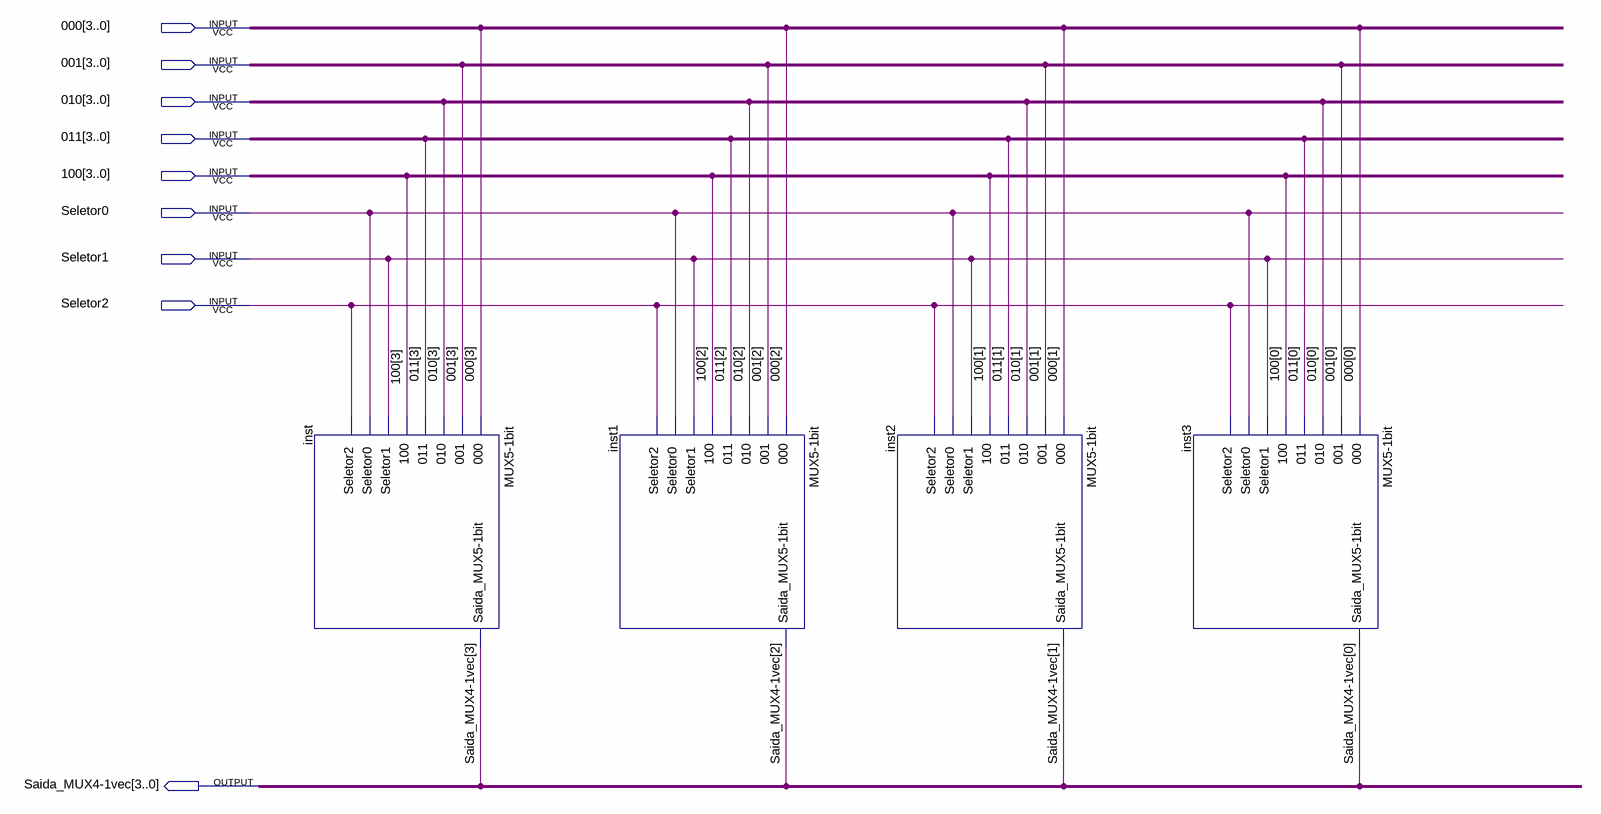
[diagram p0: schematic sheet]
// Quartus schematic MUX5-1vec.bdf as structural Verilog: 4 symbols, 9 pins
module \MUX5-1vec  (
  input  [3:0] \000 ,
  input  [3:0] \001 ,
  input  [3:0] \010 ,
  input  [3:0] \011 ,
  input  [3:0] \100 ,
  input  Seletor0,
  input  Seletor1,
  input  Seletor2,
  output [3:0] \Saida_MUX4-1vec 
);

  \MUX5-1bit  inst (
    .\000 (\000 [3]), .\001 (\001 [3]), .\010 (\010 [3]), .\011 (\011 [3]), .\100 (\100 [3]),
    .Seletor1(Seletor1), .Seletor0(Seletor0), .Seletor2(Seletor2), .\Saida_MUX5-1bit (\Saida_MUX4-1vec [3]));
  \MUX5-1bit  inst1 (
    .\000 (\000 [2]), .\001 (\001 [2]), .\010 (\010 [2]), .\011 (\011 [2]), .\100 (\100 [2]),
    .Seletor1(Seletor1), .Seletor0(Seletor0), .Seletor2(Seletor2), .\Saida_MUX5-1bit (\Saida_MUX4-1vec [2]));
  \MUX5-1bit  inst2 (
    .\000 (\000 [1]), .\001 (\001 [1]), .\010 (\010 [1]), .\011 (\011 [1]), .\100 (\100 [1]),
    .Seletor1(Seletor1), .Seletor0(Seletor0), .Seletor2(Seletor2), .\Saida_MUX5-1bit (\Saida_MUX4-1vec [1]));
  \MUX5-1bit  inst3 (
    .\000 (\000 [0]), .\001 (\001 [0]), .\010 (\010 [0]), .\011 (\011 [0]), .\100 (\100 [0]),
    .Seletor1(Seletor1), .Seletor0(Seletor0), .Seletor2(Seletor2), .\Saida_MUX5-1bit (\Saida_MUX4-1vec [0]));
endmodule
